# EAGLE design Trigger_Sequencer_build&tested (EAGLE 9.2.2)
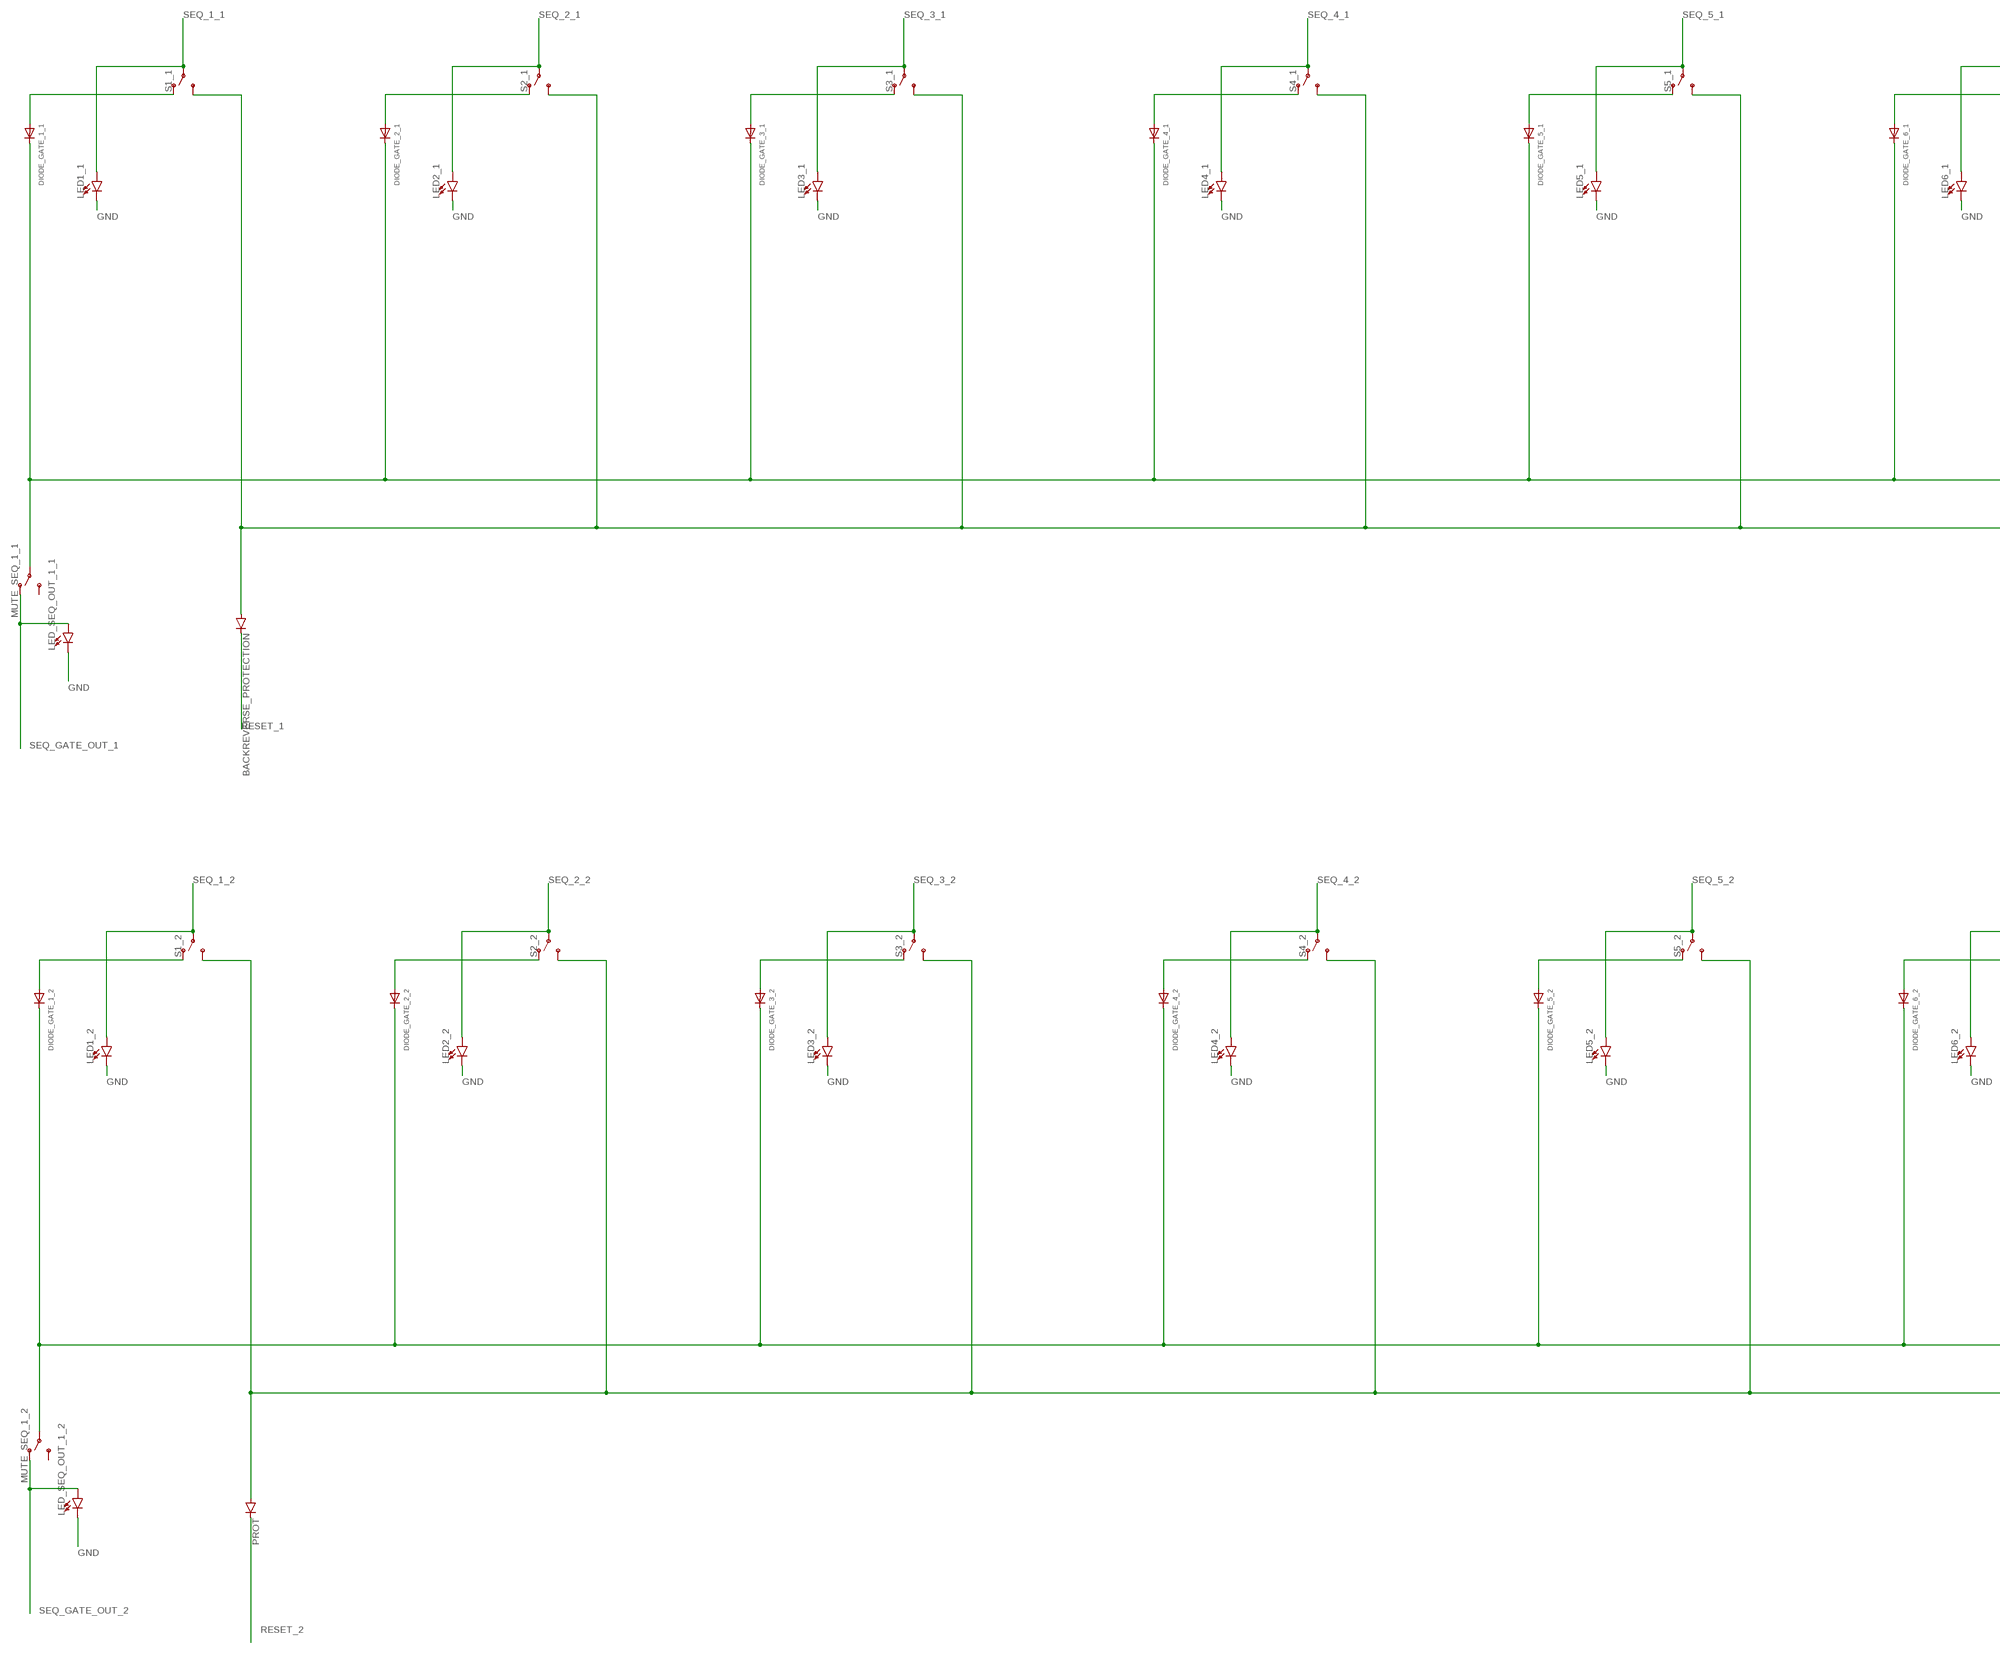
[diagram p0: schematic, sheet 1, part 1 of 2]
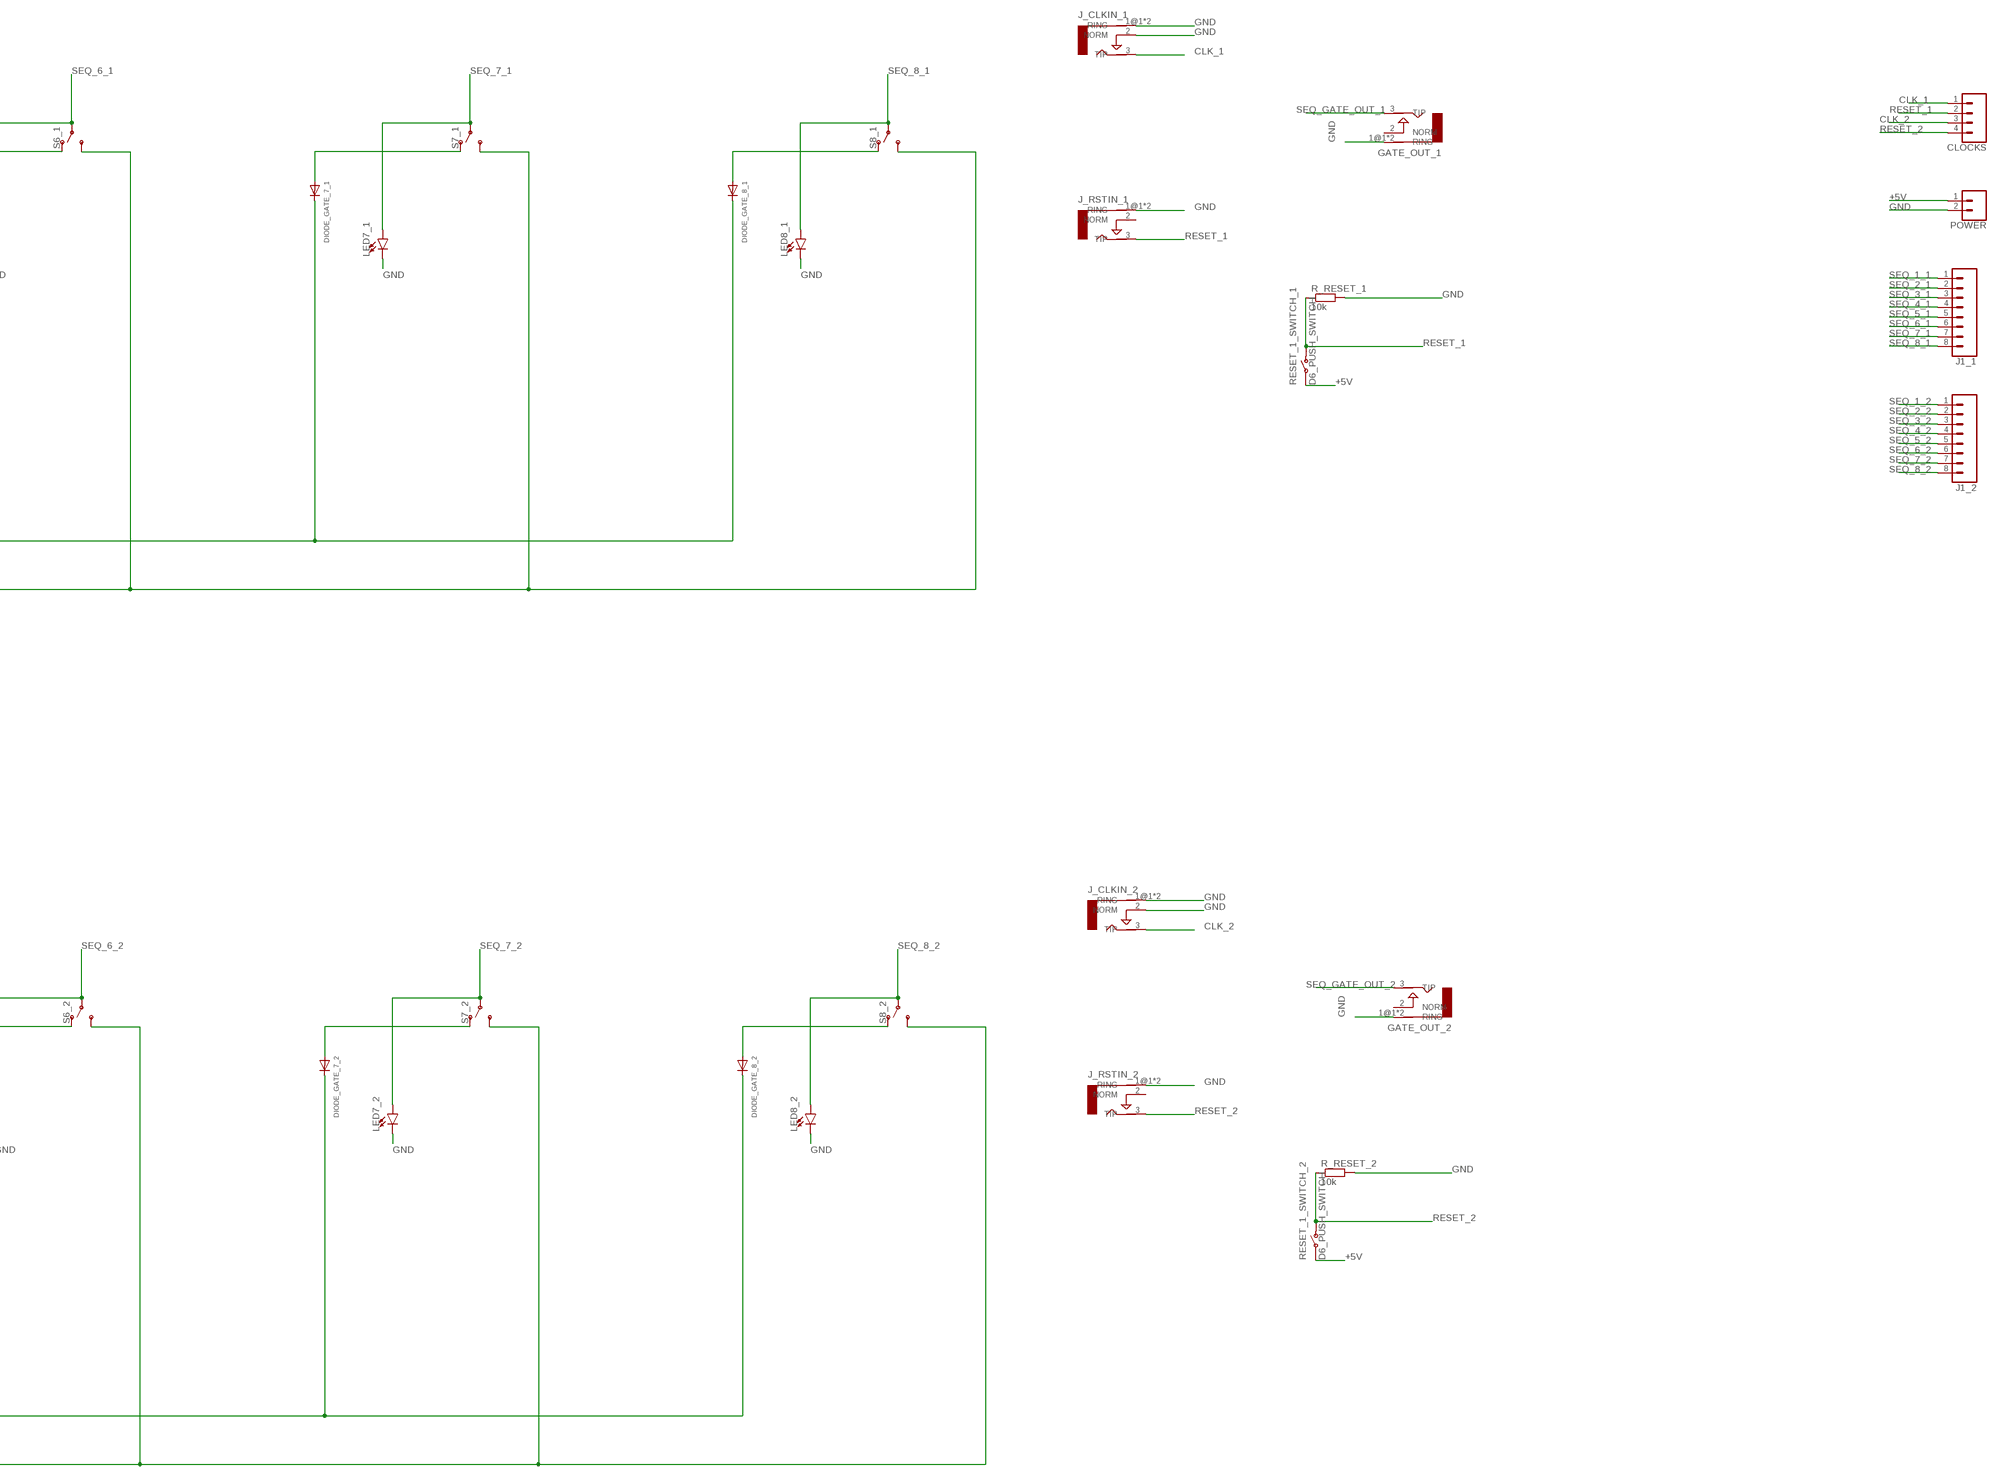
[diagram p1: schematic, sheet 1, part 2 of 2]

## Parts
BACKREVERSE_PROTECTION  DIODE1N4148  [DIODE-1N4148]
CLOCKS  CONN_04  [1X04]
DIODE_GATE_1_1  DIODEDO-1N4148  [DO-1N4148]
DIODE_GATE_1_2  DIODEDO-1N4148  [DO-1N4148]
DIODE_GATE_2_1  DIODEDO-1N4148  [DO-1N4148]
DIODE_GATE_2_2  DIODEDO-1N4148  [DO-1N4148]
DIODE_GATE_3_1  DIODEDO-1N4148  [DO-1N4148]
DIODE_GATE_3_2  DIODEDO-1N4148  [DO-1N4148]
DIODE_GATE_4_1  DIODEDO-1N4148  [DO-1N4148]
DIODE_GATE_4_2  DIODEDO-1N4148  [DO-1N4148]
DIODE_GATE_5_1  DIODEDO-1N4148  [DO-1N4148]
DIODE_GATE_5_2  DIODEDO-1N4148  [DO-1N4148]
DIODE_GATE_6_1  DIODEDO-1N4148  [DO-1N4148]
DIODE_GATE_6_2  DIODEDO-1N4148  [DO-1N4148]
DIODE_GATE_7_1  DIODEDO-1N4148  [DO-1N4148]
DIODE_GATE_7_2  DIODEDO-1N4148  [DO-1N4148]
DIODE_GATE_8_1  DIODEDO-1N4148  [DO-1N4148]
DIODE_GATE_8_2  DIODEDO-1N4148  [DO-1N4148]
GATE_OUT_1  AUDIO-JACKERTHENVAR  [ERTHENVAR-JACK]
GATE_OUT_2  AUDIO-JACKERTHENVAR  [ERTHENVAR-JACK]
J1_1  CONN_08NO_SILK_FEMALE_PTH  [1X08_NO_SILK]
J1_2  CONN_08NO_SILK_FEMALE_PTH  [1X08_NO_SILK]
J_CLKIN_1  AUDIO-JACKERTHENVAR  [ERTHENVAR-JACK]
J_CLKIN_2  AUDIO-JACKERTHENVAR  [ERTHENVAR-JACK]
J_RSTIN_1  AUDIO-JACKERTHENVAR  [ERTHENVAR-JACK]
J_RSTIN_2  AUDIO-JACKERTHENVAR  [ERTHENVAR-JACK]
LED1_1  LED-3MM-NO_SILK  [LED_3MM-NS]
LED1_2  LED-3MM-NO_SILK  [LED_3MM-NS]
LED2_1  LED-3MM-NO_SILK  [LED_3MM-NS]
LED2_2  LED-3MM-NO_SILK  [LED_3MM-NS]
LED3_1  LED-3MM-NO_SILK  [LED_3MM-NS]
LED3_2  LED-3MM-NO_SILK  [LED_3MM-NS]
LED4_1  LED-3MM-NO_SILK  [LED_3MM-NS]
LED4_2  LED-3MM-NO_SILK  [LED_3MM-NS]
LED5_1  LED-3MM-NO_SILK  [LED_3MM-NS]
LED5_2  LED-3MM-NO_SILK  [LED_3MM-NS]
LED6_1  LED-3MM-NO_SILK  [LED_3MM-NS]
LED6_2  LED-3MM-NO_SILK  [LED_3MM-NS]
LED7_1  LED-3MM-NO_SILK  [LED_3MM-NS]
LED7_2  LED-3MM-NO_SILK  [LED_3MM-NS]
LED8_1  LED-3MM-NO_SILK  [LED_3MM-NS]
LED8_2  LED-3MM-NO_SILK  [LED_3MM-NS]
LED_SEQ_OUT_1_1  LED-3MM-NO_SILK  [LED_3MM-NS]
LED_SEQ_OUT_1_2  LED-3MM-NO_SILK  [LED_3MM-NS]
MUTE_SEQ_1_1  SWITCH-SPDT-PTH-11.6X4.0MM  [SWITCH_SPDT_PTH_11.6X4.0MM]
MUTE_SEQ_1_2  SWITCH-SPDT-PTH-11.6X4.0MM  [SWITCH_SPDT_PTH_11.6X4.0MM]
POWER  CONN_02  [1X02]
PROT  DIODE1N4148  [DIODE-1N4148]
R_RESET_1  10k  RESISTORVERTICAL  [VERTICAL_RESISTOR]
R_RESET_2  10k  RESISTORVERTICAL  [VERTICAL_RESISTOR]
RESET_1_SWITCH_1  D6_PUSH_SWITCH  [D6_PUSH_SWITCH]
RESET_1_SWITCH_2  D6_PUSH_SWITCH  [D6_PUSH_SWITCH]
S1_1  SWITCH-SPDT-PTH-11.6X4.0MM  [SWITCH_SPDT_PTH_11.6X4.0MM]
S1_2  SWITCH-SPDT-PTH-11.6X4.0MM  [SWITCH_SPDT_PTH_11.6X4.0MM]
S2_1  SWITCH-SPDT-PTH-11.6X4.0MM  [SWITCH_SPDT_PTH_11.6X4.0MM]
S2_2  SWITCH-SPDT-PTH-11.6X4.0MM  [SWITCH_SPDT_PTH_11.6X4.0MM]
S3_1  SWITCH-SPDT-PTH-11.6X4.0MM  [SWITCH_SPDT_PTH_11.6X4.0MM]
S3_2  SWITCH-SPDT-PTH-11.6X4.0MM  [SWITCH_SPDT_PTH_11.6X4.0MM]
S4_1  SWITCH-SPDT-PTH-11.6X4.0MM  [SWITCH_SPDT_PTH_11.6X4.0MM]
S4_2  SWITCH-SPDT-PTH-11.6X4.0MM  [SWITCH_SPDT_PTH_11.6X4.0MM]
S5_1  SWITCH-SPDT-PTH-11.6X4.0MM  [SWITCH_SPDT_PTH_11.6X4.0MM]
S5_2  SWITCH-SPDT-PTH-11.6X4.0MM  [SWITCH_SPDT_PTH_11.6X4.0MM]
S6_1  SWITCH-SPDT-PTH-11.6X4.0MM  [SWITCH_SPDT_PTH_11.6X4.0MM]
S6_2  SWITCH-SPDT-PTH-11.6X4.0MM  [SWITCH_SPDT_PTH_11.6X4.0MM]
S7_1  SWITCH-SPDT-PTH-11.6X4.0MM  [SWITCH_SPDT_PTH_11.6X4.0MM]
S7_2  SWITCH-SPDT-PTH-11.6X4.0MM  [SWITCH_SPDT_PTH_11.6X4.0MM]
S8_1  SWITCH-SPDT-PTH-11.6X4.0MM  [SWITCH_SPDT_PTH_11.6X4.0MM]
S8_2  SWITCH-SPDT-PTH-11.6X4.0MM  [SWITCH_SPDT_PTH_11.6X4.0MM]

## Nets
+5V: POWER.1 RESET_1_SWITCH_1.P$3(P) RESET_1_SWITCH_1.P$4(P) RESET_1_SWITCH_2.P$3(P) RESET_1_SWITCH_2.P$4(P)
CLK_1: CLOCKS.1 J_CLKIN_1.3(TIP)
CLK_2: CLOCKS.3 J_CLKIN_2.3(TIP)
GND: GATE_OUT_1.1@1(RING) GATE_OUT_1.1@2(RING) GATE_OUT_2.1@1(RING) GATE_OUT_2.1@2(RING) J_CLKIN_1.1@1(RING) J_CLKIN_1.1@2(RING) J_CLKIN_1.2(NORM) J_CLKIN_2.1@1(RING) J_CLKIN_2.1@2(RING) J_CLKIN_2.2(NORM) J_RSTIN_1.1@1(RING) J_RSTIN_1.1@2(RING) J_RSTIN_2.1@1(RING) J_RSTIN_2.1@2(RING) LED1_1.K(C) LED1_2.K(C) LED2_1.K(C) LED2_2.K(C) LED3_1.K(C) LED3_2.K(C) LED4_1.K(C) LED4_2.K(C) LED5_1.K(C) LED5_2.K(C) LED6_1.K(C) LED6_2.K(C) LED7_1.K(C) LED7_2.K(C) LED8_1.K(C) LED8_2.K(C) LED_SEQ_OUT_1_1.K(C) LED_SEQ_OUT_1_2.K(C) POWER.2 R_RESET_1.2 R_RESET_2.2
N$1: DIODE_GATE_1_2.A S1_2.1(O)
N$2: DIODE_GATE_1_1.A S1_1.1(O)
N$3: DIODE_GATE_2_2.A S2_2.1(O)
N$4: DIODE_GATE_3_2.A S3_2.1(O)
N$5: DIODE_GATE_4_2.A S4_2.1(O)
N$6: DIODE_GATE_2_1.A S2_1.1(O)
N$7: DIODE_GATE_5_2.A S5_2.1(O)
N$8: DIODE_GATE_6_2.A S6_2.1(O)
N$9: DIODE_GATE_7_2.A S7_2.1(O)
N$10: DIODE_GATE_3_1.A S3_1.1(O)
N$11: DIODE_GATE_8_2.A S8_2.1(O)
N$14: DIODE_GATE_4_1.A S4_1.1(O)
N$18: DIODE_GATE_5_1.A S5_1.1(O)
N$22: DIODE_GATE_6_1.A S6_1.1(O)
N$26: DIODE_GATE_7_1.A S7_1.1(O)
N$30: DIODE_GATE_8_1.A S8_1.1(O)
RESET_1: BACKREVERSE_PROTECTION.A BACKREVERSE_PROTECTION.C CLOCKS.2 J_RSTIN_1.3(TIP) R_RESET_1.1 RESET_1_SWITCH_1.P$1(O) RESET_1_SWITCH_1.P$2(O) S1_1.3(S) S2_1.3(S) S3_1.3(S) S4_1.3(S) S5_1.3(S) S6_1.3(S) S7_1.3(S) S8_1.3(S)
RESET_2: CLOCKS.4 J_RSTIN_2.3(TIP) PROT.A PROT.C R_RESET_2.1 RESET_1_SWITCH_2.P$1(O) RESET_1_SWITCH_2.P$2(O) S1_2.3(S) S2_2.3(S) S3_2.3(S) S4_2.3(S) S5_2.3(S) S6_2.3(S) S7_2.3(S) S8_2.3(S)
SEQ_1_1: J1_1.1 LED1_1.A S1_1.2(P)
SEQ_1_2: J1_2.1 LED1_2.A S1_2.2(P)
SEQ_2_1: J1_1.2 LED2_1.A S2_1.2(P)
SEQ_2_2: J1_2.2 LED2_2.A S2_2.2(P)
SEQ_3_1: J1_1.3 LED3_1.A S3_1.2(P)
SEQ_3_2: J1_2.3 LED3_2.A S3_2.2(P)
SEQ_4_1: J1_1.4 LED4_1.A S4_1.2(P)
SEQ_4_2: J1_2.4 LED4_2.A S4_2.2(P)
SEQ_5_1: J1_1.5 LED5_1.A S5_1.2(P)
SEQ_5_2: J1_2.5 LED5_2.A S5_2.2(P)
SEQ_6_1: J1_1.6 LED6_1.A S6_1.2(P)
SEQ_6_2: J1_2.6 LED6_2.A S6_2.2(P)
SEQ_7_1: J1_1.7 LED7_1.A S7_1.2(P)
SEQ_7_2: J1_2.7 LED7_2.A S7_2.2(P)
SEQ_8_1: J1_1.8 LED8_1.A S8_1.2(P)
SEQ_8_2: J1_2.8 LED8_2.A S8_2.2(P)
SEQ_GATE_OUT_1: GATE_OUT_1.3(TIP) LED_SEQ_OUT_1_1.A MUTE_SEQ_1_1.1(O)
SEQ_GATE_OUT_2: GATE_OUT_2.3(TIP) LED_SEQ_OUT_1_2.A MUTE_SEQ_1_2.1(O)
TO_GATE_BUS: DIODE_GATE_1_1.C DIODE_GATE_2_1.C DIODE_GATE_3_1.C DIODE_GATE_4_1.C DIODE_GATE_5_1.C DIODE_GATE_6_1.C DIODE_GATE_7_1.C DIODE_GATE_8_1.C MUTE_SEQ_1_1.2(P)
TO_GATE_BUS1: DIODE_GATE_1_2.C DIODE_GATE_2_2.C DIODE_GATE_3_2.C DIODE_GATE_4_2.C DIODE_GATE_5_2.C DIODE_GATE_6_2.C DIODE_GATE_7_2.C DIODE_GATE_8_2.C MUTE_SEQ_1_2.2(P)
Unconnected: GATE_OUT_1.2(NORM) GATE_OUT_2.2(NORM) J_RSTIN_1.2(NORM) J_RSTIN_2.2(NORM) MUTE_SEQ_1_1.3(S) MUTE_SEQ_1_2.3(S)

## Library data of the parts
BACKREVERSE_PROTECTION PROT = BeagleBone_Blue_R3:DIODE: Diode
CLOCKS = SparkFun-Connectors:CONN_04: Multi connection point. Often used as Generic Header-pin footprint for 0.1 inch spaced/style header connections On any of the 0.1 inch spaced packages, you can populate with these: Break Away Headers - Straight <https://www.sparkfun.com/products/116> (PRT-00116) Break Away Male Headers - Right Angle <https://www.sparkfun.com/products/553> (PRT-00553) Female Headers <https://www.sparkfun.com/products/115> (PRT-00115) Break Away Headers - Machine Pin <https://www.sparkfun.com/products/117> (PRT-00117) Break Away Female Headers - Swiss Machine Pin <https://www.sparkfun.com/products/743> (PRT-00743) For SCREWTERMINALS and SPRING TERMINALS visit here: Screw Terimnals on SparkFun.com <https://www.sparkfun.com/search/results?term=Screw+Terminals> (5mm/3.5mm/2.54mm spacing) This device is also useful as a general connection point to wire up your design to another part of your project. Our various solder wires solder well into these plated through hole pads. Hook-Up Wire - Assortment (Stranded, 22 AWG) <https://www.sparkfun.com/products/11375> (PRT-11375) Hook-Up Wire - Assortment (Solid Core, 22 AWG) <https://www.sparkfun.com/products/11367> (PRT-11367) View the entire wire category on our website here <https://www.sparkfun.com/categories/141> Special notes: Molex polarized connector foot print use with SKU : PRT-08231 with associated crimp pins and housings. 1MM SMD Version SKU: PRT-10208; PROD_ID: CONN-09696
DIODE_GATE_1_1 DIODE_GATE_1_2 DIODE_GATE_2_1 DIODE_GATE_2_2 DIODE_GATE_3_1 DIODE_GATE_3_2 DIODE_GATE_4_1 DIODE_GATE_4_2 DIODE_GATE_5_1 DIODE_GATE_5_2 DIODE_GATE_6_1 DIODE_GATE_6_2 DIODE_GATE_7_1 DIODE_GATE_7_2 DIODE_GATE_8_1 DIODE_GATE_8_2 = adafruit:DIODE: Diode
GATE_OUT_1 GATE_OUT_2 J_CLKIN_1 J_CLKIN_2 J_RSTIN_1 J_RSTIN_2 = erthenvar:AUDIO-JACK: Switching Mono 3.5mm Audio Jack from Erthenvar.
J1_1 J1_2 = SparkFun-Connectors:CONN_08: Multi connection point. Often used as Generic Header-pin footprint for 0.1 inch spaced/style header connections On any of the 0.1 inch spaced packages, you can populate with these: Break Away Headers - Straight <https://www.sparkfun.com/products/116> (PRT-00116) Break Away Male Headers - Right Angle <https://www.sparkfun.com/products/553> (PRT-00553) Female Headers <https://www.sparkfun.com/products/115> (PRT-00115) Break Away Headers - Machine Pin <https://www.sparkfun.com/products/117> (PRT-00117) Break Away Female Headers - Swiss Machine Pin <https://www.sparkfun.com/products/743> (PRT-00743) Arduino Stackable Header - 8 Pin <https://www.sparkfun.com/products/9279> (PRT-09279) For SCREWTERMINALS and SPRING TERMINALS visit here: Screw Terimnals on SparkFun.com <https://www.sparkfun.com/search/results?term=Screw+Terminals> (5mm/3.5mm/2.54mm spacing) This device is also useful as a general connection point to wire up your design to another part of your project. Our various solder wires solder well into these plated through hole pads. Hook-Up Wire - Assortment (Stranded, 22 AWG) <https://www.sparkfun.com/products/11375> (PRT-11375) Hook-Up Wire - Assortment (Solid Core, 22 AWG) <https://www.sparkfun.com/products/11367> (PRT-11367) View the entire wire category on our website here <https://www.sparkfun.com/categories/141> Special notes: Molex polarized connector foot print use with SKU : PRT-08231 with associated crimp pins and housings. 1MM SMD Version SKU: PRT-10208 NOTES ON THE VARIANTS LOCK and LOCK_LONGPADS... This footprint was designed to help hold the alignment of a through-hole component (i.e. 6-pin header) while soldering it into place. You may notice that each hole has been shifted either up or down by 0.005 of an inch from it's more standard position (which is a perfectly straight line). This slight alteration caused the pins (the squares in the middle) to touch the edges of the holes. Because they are alternating, it causes a "brace" to hold the component in place. 0.005 has proven to be the perfect amount of "off-center" position when using our standard breakaway headers. Although looks a little odd when you look at the bare footprint, once you have a header in there, the alteration is very hard to notice. Also,if you push a header all the way into place, it is covered up entirely on the bottom side.; PROD_ID: CONN-08438
LED1_1 LED1_2 LED2_1 LED2_2 LED3_1 LED3_2 LED4_1 LED4_2 LED5_1 LED5_2 LED6_1 LED6_2 LED7_1 LED7_2 LED8_1 LED8_2 LED_SEQ_OUT_1_1 LED_SEQ_OUT_1_2 = SparkFun-LED:LED: LED (Generic) Standard schematic elements and footprints for 5mm, 3mm, 1206, and 0603 sized LEDs. Generic LEDs with no color specified.
MUTE_SEQ_1_1 MUTE_SEQ_1_2 S1_1 S1_2 S2_1 S2_2 S3_1 S3_2 S4_1 S4_2 S5_1 S5_2 S6_1 S6_2 S7_1 S7_2 S8_1 S8_2 = SPDT_Switches_Thonk:SWITCH-SPDT: Single Pole, Double Throw (SPDT) Switch; PROD_ID: SWCH-08261; SF_SKU: COM-00102
POWER = SparkFun-Connectors:CONN_02: Multi connection point. Often used as Generic Header-pin footprint for 0.1 inch spaced/style header connections On any of the 0.1 inch spaced packages, you can populate with these: Break Away Headers - Straight <https://www.sparkfun.com/products/116> (PRT-00116) Break Away Male Headers - Right Angle <https://www.sparkfun.com/products/553> (PRT-00553) Female Headers <https://www.sparkfun.com/products/115> (PRT-00115) Break Away Headers - Machine Pin <https://www.sparkfun.com/products/117> (PRT-00117) Break Away Female Headers - Swiss Machine Pin <https://www.sparkfun.com/products/743> (PRT-00743) For SCREWTERMINALS and SPRING TERMINALS visit here: Screw Terimnals on SparkFun.com <https://www.sparkfun.com/search/results?term=Screw+Terminals> (5mm/3.5mm/2.54mm spacing) This device is also useful as a general connection point to wire up your design to another part of your project. Our various solder wires solder well into these plated through hole pads. Hook-Up Wire - Assortment (Stranded, 22 AWG) <https://www.sparkfun.com/products/11375> (PRT-11375) Hook-Up Wire - Assortment (Solid Core, 22 AWG) <https://www.sparkfun.com/products/11367> (PRT-11367) View the entire wire category on our website here <https://www.sparkfun.com/categories/141> Special notes: Molex polarized connector foot print use with: PRT-08233 with associated crimp pins and housings. 2.54_SCREWTERM for use with PRT-10571. 3.5mm Screw Terminal footprints for PRT-08084 5mm Screw Terminal footprints for use with PRT-08432
R_RESET_1 R_RESET_2 = MusicThingModular:RESISTOR: Standard resistor, various versions
RESET_1_SWITCH_1 RESET_1_SWITCH_2 = MusicThingModular:D6_PUSH_SWITCH: Push switch

## Board
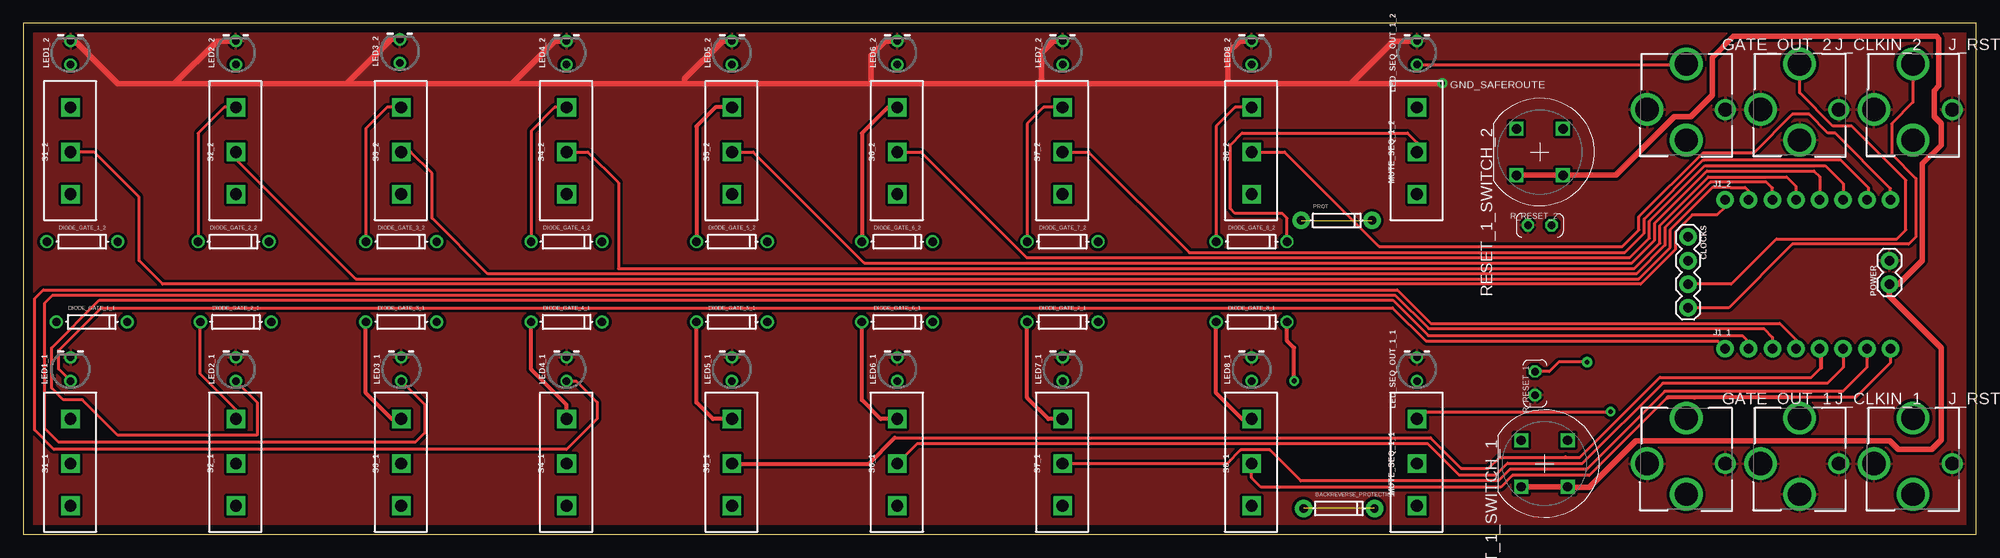
[diagram p2: board, top side]
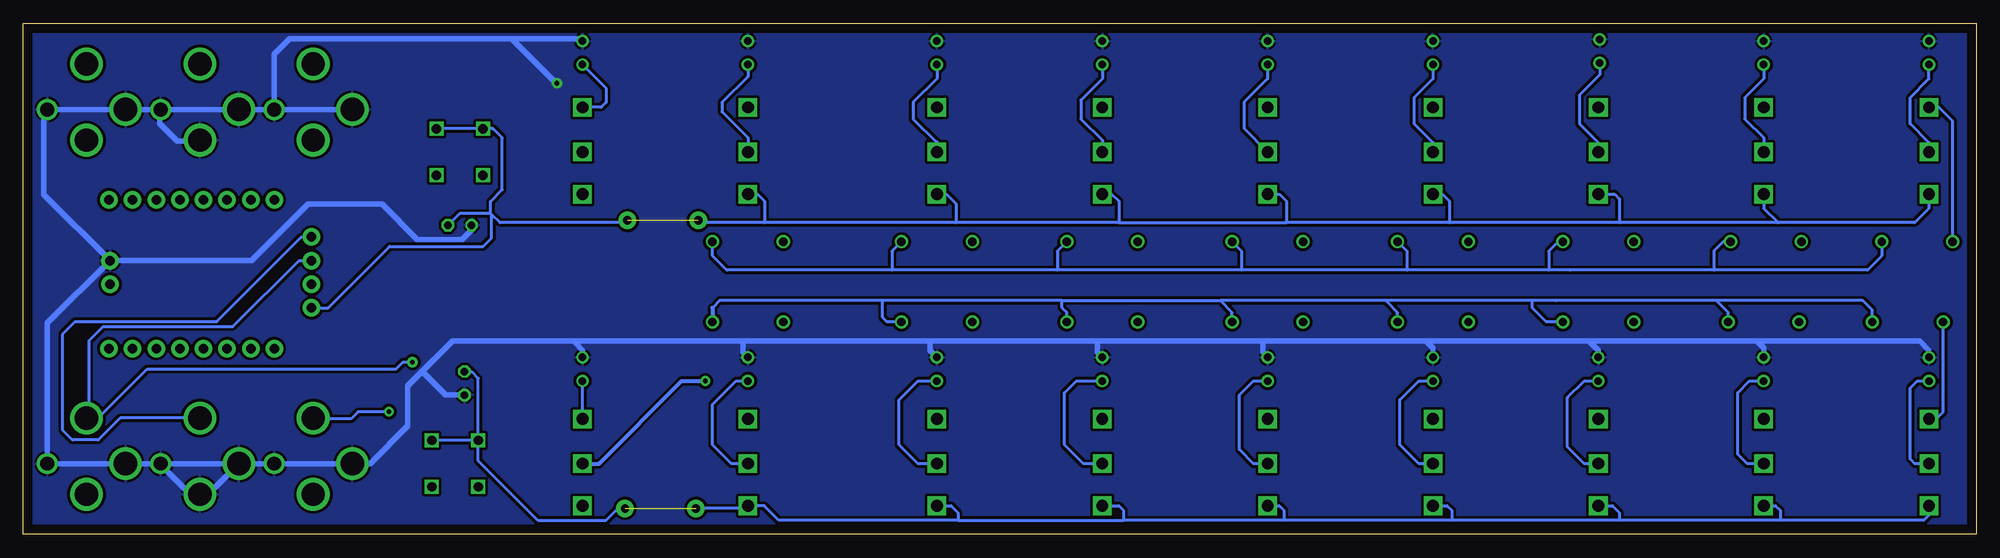
[diagram p3: board, bottom side, seen from below]

Size 210 x 55 mm. Coordinates in mm from the lower left corner, seen from the top.
Outline: 0,0 210,0 210,55 0,55 0,0
Copper layers (1*16): Top 0.035mm / dielectric 1.5mm / Bottom 0.035mm
Design rules "default *": minimum track width 6mil, minimum drill 0.35mm, track to track 10mil, track to pad 10mil, pad to pad 10mil, via to via 10mil, smd to smd 6mil, copper to edge 40mil, drill to drill 10mil, minimum pad ring 10mil, minimum via ring 8mil, stop-mask expansion 4mil, vias tented up to drill 0mil, thermal gap 10mil

### Footprints (pad centres in the part's own frame; a part is rotated, then mirrored left to right if it is on the bottom)
DIODE-1N4148 = drill 0.9 pad 1.88: A -3.81,0; C 3.81,0
1X04 = drill 1.016 pad 1.88: 1 0,0; 2 2.54,0; 3 5.08,0; 4 7.62,0
DO-1N4148 = drill 0.9: A -3.81,0; C 3.81,0
ERTHENVAR-JACK = drill 2.5: 1@1 -4.2,0; 2 0,-3.3; 3 0,4.9 | drill 1.5: 1@2 4.2,0
1X08_NO_SILK = drill 1.016 pad 1.88: 1 0,0; 2 2.54,0; 3 5.08,0; 4 7.62,0; 5 10.16,0; 6 12.7,0; 7 15.24,0; 8 17.78,0
LED_3MM-NS = drill 0.813: A -1.27,0; K 1.27,0
SWITCH_SPDT_PTH_11.6X4.0MM = drill 1.27 pad 2 square: 1 0,4.8; 2 0,0; 3 0,-4.54
1X02 = drill 1.016 pad 1.88: 1 0,0; 2 2.54,0
VERTICAL_RESISTOR = drill 0.813 octagon: 1 -1.27,0; 2 1.27,0
D6_PUSH_SWITCH = drill 1 square: P$1 -2.5,2.5; P$2 2.5,2.5; P$3 2.5,-2.5; P$4 -2.5,-2.5

### Placement (x,y rotation side)
BACKREVERSE_PROTECTION  141.48,2.79 0 top
CLOCKS  179,32 270 top
DIODE_GATE_1_1  7.37,22.86 0 top
DIODE_GATE_1_2  6.35,31.5 0 top
DIODE_GATE_2_1  22.86,22.86 0 top
DIODE_GATE_2_2  22.61,31.5 0 top
DIODE_GATE_3_1  40.64,22.86 0 top
DIODE_GATE_3_2  40.64,31.5 0 top
DIODE_GATE_4_1  58.42,22.86 0 top
DIODE_GATE_4_2  58.42,31.5 0 top
DIODE_GATE_5_1  76.2,22.86 0 top
DIODE_GATE_5_2  76.2,31.5 0 top
DIODE_GATE_6_1  93.98,22.86 0 top
DIODE_GATE_6_2  93.98,31.5 0 top
DIODE_GATE_7_1  111.76,22.86 0 top
DIODE_GATE_7_2  111.76,31.5 0 top
DIODE_GATE_8_1  132.08,22.86 0 top
DIODE_GATE_8_2  132.08,31.5 0 top
GATE_OUT_1  178.82,7.62 0 top
GATE_OUT_2  178.82,45.72 0 top
J1_1  183,20 0 top
J1_2  183,36 0 top
J_CLKIN_1  191.01,7.62 0 top
J_CLKIN_2  191.01,45.72 0 top
J_RSTIN_1  203.2,7.62 0 top
J_RSTIN_2  203.2,45.72 0 top
LED1_1  5.08,17.78 90 top
LED1_2  5.08,51.82 90 top
LED2_1  22.86,17.78 90 top
LED2_2  22.86,51.82 90 top
LED3_1  40.64,17.78 90 top
LED3_2  40.49,51.98 90 top
LED4_1  58.42,17.78 90 top
LED4_2  58.42,51.82 90 top
LED5_1  76.2,17.78 90 top
LED5_2  76.2,51.82 90 top
LED6_1  93.98,17.78 90 top
LED6_2  93.98,51.82 90 top
LED7_1  111.76,17.78 90 top
LED7_2  111.76,51.82 90 top
LED8_1  132.08,17.78 90 top
LED8_2  132.08,51.82 90 top
LED_SEQ_OUT_1_1  149.86,17.78 90 top
LED_SEQ_OUT_1_2  149.86,51.82 90 top
MUTE_SEQ_1_1  149.86,7.62 0 top
MUTE_SEQ_1_2  149.86,41.15 0 top
POWER  200.66,26.92 90 top
PROT  141.22,33.78 0 top
R_RESET_1  162.56,16.26 270 top
R_RESET_2  163.07,33.27 180 top
RESET_1_SWITCH_1  163.58,7.62 0 top
RESET_1_SWITCH_2  163.07,41.15 0 top
S1_1  5.08,7.62 0 top
S1_2  5.08,41.15 0 top
S2_1  22.86,7.62 0 top
S2_2  22.86,41.15 0 top
S3_1  40.64,7.62 0 top
S3_2  40.64,41.15 0 top
S4_1  58.42,7.62 0 top
S4_2  58.42,41.15 0 top
S5_1  76.2,7.62 0 top
S5_2  76.2,41.15 0 top
S6_1  93.98,7.62 0 top
S6_2  93.98,41.15 0 top
S7_1  111.76,7.62 0 top
S7_2  111.76,41.15 0 top
S8_1  132.08,7.62 0 top
S8_2  132.08,41.15 0 top

### Tracks (layer width: path | path; a pad name or v marks a point on that pad's centre or on a via)
+5V
  Top 0.61: RESET_1_SWITCH_1.P$4 RESET_1_SWITCH_1.P$3 166.12,5.08 168.4,5.08 173.41,10.09 200.68,10.09 201.62,9.14 205.23,9.14 206.25,10.16 206.25,20.07 200.66,25.65 POWER.1 201.68,26.92 204.22,29.46 204.22,39.88 206.25,41.91 206.25,44.2 205.49,44.96 205.49,47.75 205.99,48.26 205.99,53.34 205.74,53.59 183.9,53.59 181.61,51.31 181.61,47.24 179.32,44.96 177.55,44.96 171.24,38.65 RESET_1_SWITCH_2.P$3 RESET_1_SWITCH_2.P$4
CLK_1
  Bottom 0.305: J_CLKIN_1.3 199.57,12.52 201.93,10.16 204.72,10.16 205.74,11.18 205.74,21.59 204.42,22.91 189.18,22.91 180.09,32 CLOCKS.1
CLK_2
  Top 0.305: CLOCKS.3 183.64,26.92 188.52,31.8 201.47,31.8 202.44,32.77 202.44,38.1 196.6,43.94 194.59,43.94 191.01,47.53 J_CLKIN_2.3
GND  (via drill 0.5 pad 1.1)
  Top 0.61: LED1_2.K 5.59,53.09 10.16,48.51 16.26,48.51 | 109.47,48.51 91.19,48.51 | 91.19,48.51 71.12,48.51 | 71.12,48.51 52.58,48.51 | 52.58,48.51 34.8,48.51 | 34.8,48.51 16.26,48.51 | LED2_2.K 20.83,53.09 16.26,48.51 | LED3_2.K 39.54,53.25 34.8,48.51 | LED4_2.K 57.15,53.09 52.58,48.51 | LED5_2.K 75.18,53.09 71.12,49.02 71.12,48.51 | LED6_2.K 92.71,53.09 91.19,51.56 91.19,48.51 | LED7_2.K 110.74,53.09 109.47,51.82 109.47,48.51 | 142.75,48.51 147.32,53.09 LED_SEQ_OUT_1_2.K | 109.47,48.51 129.54,48.51 | 129.54,48.51 142.75,48.51 | LED8_2.K 130.81,53.09 129.54,51.82 129.54,48.51 | v152.61,48.56 152.56,48.51 142.75,48.51
  Bottom 0.61: POWER.2 207.77,36.58 207.77,45.35 J_RSTIN_2.1@2 J_RSTIN_2.1@1 J_CLKIN_2.1@2 | J_CLKIN_2.1@2 194.31,45.72 | J_CLKIN_2.1@2 186.44,45.72 186.18,45.47 187.06,45.47 J_CLKIN_2.1@1 GATE_OUT_2.1@2 | GATE_OUT_2.1@2 GATE_OUT_2.1@1 | POWER.2 207.4,22.72 J_RSTIN_1.1@2 J_RSTIN_1.1@1 J_CLKIN_1.1@2 | J_CLKIN_1.1@2 J_CLKIN_1.1@1 | J_CLKIN_1.1@2 194.82,7.23 194.82,7.11 192.03,4.32 J_CLKIN_1.2 190.11,4.32 J_CLKIN_1.1@1 | J_CLKIN_1.1@1 GATE_OUT_1.1@2 GATE_OUT_1.1@1 172.72,7.62 168.66,11.68 168.66,16 167.13,17.53 | GATE_OUT_2.1@2 183.02,51.68 181.35,53.34 157.48,53.34 | POWER.2 185.42,29.46 179.36,35.53 171.42,35.53 167.64,31.75 162.81,31.75 161.8,32.77 R_RESET_2.2 | LED_SEQ_OUT_1_2.K 150.12,53.34 157.48,53.34 | LED1_1.K 5.08,19.81 6.1,20.83 23.62,20.83 | 150.37,20.83 150.62,20.57 149.86,19.81 LED_SEQ_OUT_1_1.K | 150.37,20.83 132.59,20.83 | 132.59,20.83 112.52,20.83 | 112.52,20.83 94.49,20.83 | 94.49,20.83 76.71,20.83 | 76.71,20.83 59.18,20.83 | 59.18,20.83 41.66,20.83 | 41.66,20.83 23.62,20.83 | LED2_1.K 22.86,20.07 23.62,20.83 | LED3_1.K 40.64,19.81 41.66,20.83 | LED4_1.K 58.42,20.07 59.18,20.83 | LED5_1.K 76.71,19.56 76.71,20.83 | LED6_1.K 94.49,19.56 94.49,20.83 | LED7_1.K 112.52,19.81 112.52,20.83 | LED8_1.K 132.59,19.56 132.59,20.83 | 157.48,53.34 152.65,48.52 v152.61,48.56 | 150.37,20.83 163.83,20.83 167.13,17.53 | R_RESET_1.2 164.59,14.99 167.13,17.53 | J_CLKIN_2.2 191.01,42.29 193.42,42.29 195.33,44.2 195.33,45.6 J_CLKIN_2.1@2
  pour Top (isolate 0.305): 0,0 0,54.86 210.06,54.86 210.06,0
  pour Bottom (isolate 0.305): 0,0 0,54.86 210.06,54.86 210.06,0
N$1
  Bottom 0.305: DIODE_GATE_1_2.A 2.54,44.45 4.04,45.95 S1_2.1
N$2
  Bottom 0.305: 4.32,12.42 3.56,13.18 DIODE_GATE_1_1.A
  Bottom 0.406: S1_1.1 4.32,12.42
N$3
  Top 0.305: S2_2.1 21.59,45.95 18.8,43.15 DIODE_GATE_2_2.A
N$4
  Top 0.305: S3_2.1 39.12,45.95 36.83,43.66 DIODE_GATE_3_2.A
N$5
  Top 0.305: S4_2.1 57.15,45.95 54.61,43.41 DIODE_GATE_4_2.A
N$6
  Top 0.305: S2_1.1 22.86,13.44 19.05,17.25 DIODE_GATE_2_1.A
N$7
  Top 0.406: S5_2.1 74.42,45.95 72.39,43.92 DIODE_GATE_5_2.A
N$8
  Top 0.406: S6_2.1 92.96,45.95 90.17,43.15 DIODE_GATE_6_2.A
N$9
  Top 0.305: S7_2.1 109.73,45.95 107.95,44.17 DIODE_GATE_7_2.A
N$10
  Top 0.406: S3_1.1 39.62,12.42 36.83,15.21 DIODE_GATE_3_1.A
N$11
  Top 0.305: S8_2.1 130.3,45.95 128.27,43.92 DIODE_GATE_8_2.A
N$14
  Top 0.406: S4_1.1 58.42,13.94 54.61,17.75 DIODE_GATE_4_1.A
N$18
  Top 0.406: S5_1.1 74.17,12.42 72.39,14.2 DIODE_GATE_5_1.A
N$22
  Top 0.406: S6_1.1 92.2,12.42 90.17,14.45 DIODE_GATE_6_1.A
N$26
  Top 0.406: S7_1.1 110.24,12.42 107.95,14.71 DIODE_GATE_7_1.A
N$30
  Top 0.406: S8_1.1 131.06,12.42 128.27,15.21 DIODE_GATE_8_1.A
RESET_1  (via drill 0.5 pad 1.1)  (1 unrouted)
  Top 0.305: v168.15,18.54 165.1,18.54 164.08,17.53 R_RESET_1.1
  Bottom 0.305: S1_1.3 5.08,2.06 5.62,1.52 21.08,1.52 | 21.08,1.52 38.35,1.52 | 38.35,1.52 56.39,1.52 | 56.39,1.52 74.42,1.52 | 74.42,1.52 91.69,1.52 | RESET_1_SWITCH_1.P$1 161.08,7.91 154.69,1.52 147.32,1.52 146.05,2.79 BACKREVERSE_PROTECTION.C | S7_1.3 110.24,3.08 109.47,2.32 109.47,1.52 | S6_1.3 92.2,3.08 91.69,2.57 91.69,1.52 | S5_1.3 74.93,3.08 74.42,2.57 74.42,1.52 | S4_1.3 56.9,3.08 56.39,2.57 56.39,1.52 | S3_1.3 39.12,3.08 38.35,2.32 38.35,1.52 | S2_1.3 21.59,3.08 21.08,2.57 21.08,1.52 | RESET_1_SWITCH_1.P$1 RESET_1_SWITCH_1.P$2 | RESET_1_SWITCH_1.P$1 161.08,16.8 161.8,17.53 R_RESET_1.1 | CLOCKS.2 180.35,29.46 187.46,22.35 201.42,22.35 202.95,20.83 202.95,12.77 J_RSTIN_1.3 201.93,12.52 196.67,17.78 169.93,17.78 169.16,18.54 v168.15,18.54 | 109.47,1.52 91.69,1.52 | 109.47,1.52 128.78,1.52 130.33,3.08 S8_1.3 | S8_1.3 132.11,3.05 | S8_1.3 132.37,2.79 BACKREVERSE_PROTECTION.A
RESET_2  (1 unrouted)
  Top 0.305: J_RSTIN_2.3 203.2,46.48 200.91,44.2 200.91,40.89 203.5,38.3 203.5,32 202.74,31.24 190.25,31.24 183.38,24.38 CLOCKS.4
  Bottom 0.305: S1_2.3 5.08,35.08 6.64,33.53 21.3,33.53 | 21.3,33.53 38.35,33.53 | 38.35,33.53 56.64,33.53 | 56.64,33.53 74.17,33.53 | 92.2,33.53 109.73,33.53 | S2_2.3 22.86,35.08 21.3,33.53 | S3_2.3 38.86,36.61 38.35,36.1 38.35,33.53 | S4_2.3 57.4,36.61 56.64,35.85 56.64,33.53 | S5_2.3 74.93,36.61 74.17,35.85 74.17,33.53 | S6_2.3 92.96,36.61 92.2,35.85 92.2,33.53 | S7_2.3 110.74,36.61 109.73,35.59 109.73,33.53 | 109.73,33.53 130.3,33.53 | S8_2.3 131.06,36.61 130.3,35.85 130.3,33.53 | 130.3,33.53 137.16,33.53 PROT.A | 159.64,34.42 158.75,33.53 145.29,33.53 PROT.C | 159.64,34.42 159.77,34.54 | 159.77,34.54 163.07,34.54 R_RESET_2.1 | 159.77,34.54 159.77,35.81 158.5,37.08 158.5,42.67 159.51,43.69 159.55,43.65 RESET_1_SWITCH_2.P$1 RESET_1_SWITCH_2.P$2 | CLOCKS.4 177.22,24.38 170.61,30.99 160.53,30.99 159.64,31.88 159.64,34.42 | 92.2,33.53 74.17,33.53
SEQ_1_1
  Top 0.305: J1_1.1 182.24,20.76 150.85,20.76 147.23,24.38 8.38,24.38 3.81,19.81 3.81,17.78 LED1_1.A
  Bottom 0.305: S1_1.2 6.6,7.62 7.11,8.13 7.11,15.75 6.35,16.51 LED1_1.A
SEQ_1_2
  Top 0.305: J1_2.1 183,35.24 182.12,34.36 179.46,34.36 177.65,32.56 177.65,30.65 173.92,26.92 14.99,26.92 12.45,29.46 12.45,36.32 7.62,41.15 S1_2.2
  Bottom 0.305: LED1_2.A 5.08,49.02 7.11,46.99 7.11,44.2 5.08,42.16 S1_2.2
SEQ_2_1
  Top 0.305: LED2_1.A 25.15,14.22 25.15,10.67 10.16,10.67 6.35,14.48 4.32,14.48 3.05,15.75 3.05,20.07 8.18,25.2 147.27,25.2 151.07,21.4 184.85,21.4 185.54,20.71 J1_1.2
  Bottom 0.305: S2_1.2 24.64,7.62 25.65,8.64 25.65,15.24 24.38,16.51 LED2_1.A
SEQ_2_2
  Top 0.305: S2_2.2 22.86,40.39 35.76,27.48 173.69,27.48 177.09,30.89 177.09,32.79 181.65,37.35 183.56,37.35 183.57,37.34 185.17,37.34 185.54,36.96 J1_2.2
  Bottom 0.305: LED2_2.A 22.86,49.02 24.89,46.99 24.89,44.7 22.86,42.67 S2_2.2
SEQ_3_1
  Top 0.305: LED3_1.A 43.18,13.97 43.18,10.92 42.16,9.91 3.81,9.91 2.29,11.43 2.29,24.89 3.15,25.76 147.5,25.76 151.12,22.13 187.16,22.13 188.08,21.22 J1_1.3
  Bottom 0.305: S3_1.2 42.16,7.62 43.94,9.4 43.94,14.73 42.16,16.51 LED3_1.A
SEQ_3_2
  Top 0.305: J1_2.3 188.08,37.27 187.44,37.91 181.42,37.91 176.54,33.02 176.54,31.12 173.46,28.04 49.94,28.04 43.94,34.04 43.94,38.86 41.66,41.15 S3_2.2
  Bottom 0.305: LED3_2.A 40.49,49.44 42.67,47.26 42.67,44.2 40.64,42.16 S3_2.2
SEQ_4_1
  Top 0.305: LED4_1.A 59.44,16.51 61.72,14.22 61.72,12.45 58.42,9.14 3.3,9.14 1.22,11.23 1.22,25.38 2.16,26.31 147.75,26.31 151.36,22.71 188.87,22.71 190.62,20.96 J1_1.4
  Bottom 0.305: S4_1.2 59.94,7.62 61.98,9.65 61.98,14.48 59.94,16.51 LED4_1.A
SEQ_4_2
  Top 0.305: S4_2.2 60.71,41.15 64.01,37.85 64.01,28.6 173.23,28.6 175.98,31.35 175.98,33.25 181.19,38.46 189.63,38.46 190.62,37.47 J1_2.4
  Bottom 0.305: LED4_2.A 58.42,49.02 60.45,46.99 60.45,44.2 58.42,42.16 S4_2.2
SEQ_5_1
  Top 0.305: 93.71,10.4 151.32,10.4 154.6,7.11 157.56,7.11 158.76,8.31 165.79,8.31 | 165.79,8.31 165.86,8.38 | 165.79,8.31 167.4,8.31 176,16.92 192.28,16.92 193.29,17.93
  Top 0.406: S5_1.2 90.93,7.62 93.71,10.4 | J1_1.5 193.29,19.87 193.29,17.93
  Bottom 0.305: S5_1.2 77.72,7.62 79.25,9.14 79.25,14.99 77.72,16.51 LED5_1.A
SEQ_5_2
  Top 0.305: S5_2.2 78.49,41.15 90.42,29.21 172.97,29.21 175.42,31.66 175.42,33.48 181.05,39.12 192.53,39.12 193.16,38.49 J1_2.5
  Bottom 0.305: LED5_2.A 76.2,49.02 78.74,46.48 78.74,43.69 S5_2.2
SEQ_6_1
  Top 0.305: J1_1.6 195.7,17.97 193.99,16.26 176.28,16.26 167.67,7.65 159.59,7.65 158.33,6.4 154.38,6.4 151.04,9.74 96.1,9.74 S6_1.2
  Bottom 0.305: S6_1.2 96.01,7.62 98.04,9.65 98.04,15.24 96.77,16.51 LED6_1.A
SEQ_6_2
  Top 0.305: S6_2.2 96.52,41.15 107.9,29.77 172.74,29.77 174.86,31.89 174.86,33.72 180.82,39.67 193.75,39.67 195.7,37.73 J1_2.6
  Bottom 0.305: LED6_2.A 93.98,49.02 96.27,46.74 96.27,44.7 93.98,42.42 S6_2.2
SEQ_7_1
  Top 0.305: J1_1.7 198.24,17.97 195.67,15.4 176.51,15.4 168.11,6.99 159.86,6.99 158.61,5.74 137.38,5.74 134.04,9.08 130.89,9.08 129.43,7.62 S7_1.2
  Bottom 0.305: S7_1.2 113.79,7.62 115.82,9.65 115.82,14.48 113.79,16.51 LED7_1.A
SEQ_7_2
  Top 0.305: S7_2.2 114.55,41.15 125.37,30.33 172.21,30.33 174.3,32.42 174.3,33.95 180.66,40.31 180.71,40.26 195.46,40.26 198.37,37.34 198.37,36.13 J1_2.7
  Bottom 0.305: LED7_2.A 111.76,49.02 114.3,46.48 114.3,44.7 111.76,42.16
  Bottom 0.406: 111.76,42.16 S7_2.2
SEQ_8_1
  Top 0.305: J1_1.8 200.78,18.48 197.04,14.73 191.93,14.73 190.09,14.73 | 176.79,14.73 168.38,6.33 160.13,6.33 158.88,5.08 133.1,5.08 132.08,6.1 S8_1.2
  Top 0.406: 190.09,14.73 179.74,14.73 179.73,14.73 176.79,14.73
  Bottom 0.305: S8_1.2 133.86,7.62 135.89,9.65 135.89,13.97 133.35,16.51 LED8_1.A
SEQ_8_2
  Top 0.305: S8_2.2 135.64,41.15 145.8,30.99 171.96,30.99 173.74,32.77 173.74,34.18 180.61,41.05 186.08,41.05 190.25,45.21 192.02,45.21 194.06,43.18 194.82,43.18 200.78,37.22 J1_2.8
  Bottom 0.305: LED8_2.A 132.08,49.28 134.87,46.48 134.87,45.47 132.08,42.67 S8_2.2
SEQ_GATE_OUT_1  (via drill 0.5 pad 1.05)
  Top 0.305: MUTE_SEQ_1_1.1 150.65,13.21 v170.69,13.21
  Bottom 0.305: MUTE_SEQ_1_1.1 LED_SEQ_OUT_1_1.A | v170.69,13.21 173.99,13.21 174.75,12.45 178.74,12.45 GATE_OUT_1.3
SEQ_GATE_OUT_2
  Top 0.305: LED_SEQ_OUT_1_2.A 178.74,50.55 GATE_OUT_2.3
  Bottom 0.305: LED_SEQ_OUT_1_2.A 147.32,48.01 147.32,46.48 147.85,45.95 MUTE_SEQ_1_2.1
TO_GATE_BUS  (via drill 0.5 pad 1.05)
  Top 0.406: v136.65,16.51 136.65,20.07 135.89,20.83 DIODE_GATE_8_1.C
  Bottom 0.305: DIODE_GATE_1_1.C 11.18,24.13 12.19,25.15 27.94,25.15 | 27.94,25.15 45.21,25.15 47.75,25.15 | 47.75,25.15 63.5,25.15 | 63.5,25.15 81.28,25.15 | 98.3,25.15 117.6,25.15 | 117.6,25.15 135.13,25.15 135.89,24.38 | DIODE_GATE_7_1.C 117.09,22.86 117.6,23.37 117.6,25.15 | DIODE_GATE_6_1.C 97.79,23.88 98.3,24.38 98.3,25.15 | 81.28,25.15 80.01,23.88 DIODE_GATE_5_1.C | 63.5,25.15 62.23,23.88 DIODE_GATE_4_1.C | 27.94,25.15 26.67,23.88 DIODE_GATE_2_1.C | 98.3,25.15 81.28,25.15 | DIODE_GATE_3_1.C 46.23,22.86 47.75,24.38 47.75,25.15
  Bottom 0.406: 135.89,24.38 DIODE_GATE_8_1.C | MUTE_SEQ_1_1.2 148.08,7.62 139.19,16.51 v136.65,16.51
TO_GATE_BUS1
  Top 0.305: DIODE_GATE_8_2.C 135.89,34.04 135.38,34.54 130.3,34.54 129.79,35.05 129.79,41.91 131.06,43.18 148.84,43.18 149.86,42.16 MUTE_SEQ_1_2.2
  Bottom 0.305: DIODE_GATE_1_2.C 10.16,29.97 11.68,28.45 28.19,28.45 | DIODE_GATE_8_2.C 135.89,29.97 134.37,28.45 116.59,28.45 | 28.19,28.45 43.69,28.45 45.97,28.45 | 45.97,28.45 61.21,28.45 | 61.21,28.45 78.99,28.45 | 78.99,28.45 98.81,28.45 | 98.81,28.45 116.59,28.45 | DIODE_GATE_2_2.C 27.18,31.5 28.19,30.48 28.19,28.45 | 44.96,31.5 45.97,30.48 45.97,28.45 | DIODE_GATE_4_2.C 61.21,30.48 61.21,28.45 | DIODE_GATE_5_2.C 78.99,30.48 78.99,28.45 | DIODE_GATE_6_2.C 98.81,30.48 98.81,28.45 | DIODE_GATE_7_2.C 116.59,30.48 116.59,28.45
  Bottom 0.406: DIODE_GATE_3_2.C 44.96,31.5

### Text on the board
tNames: GND_SAFEROUTE